# Altium schematic sheet 21_POWER_PWR_SEN.SchDoc
size 420 x 297 mm; SheetNumber: 34; SheetTotal: 36
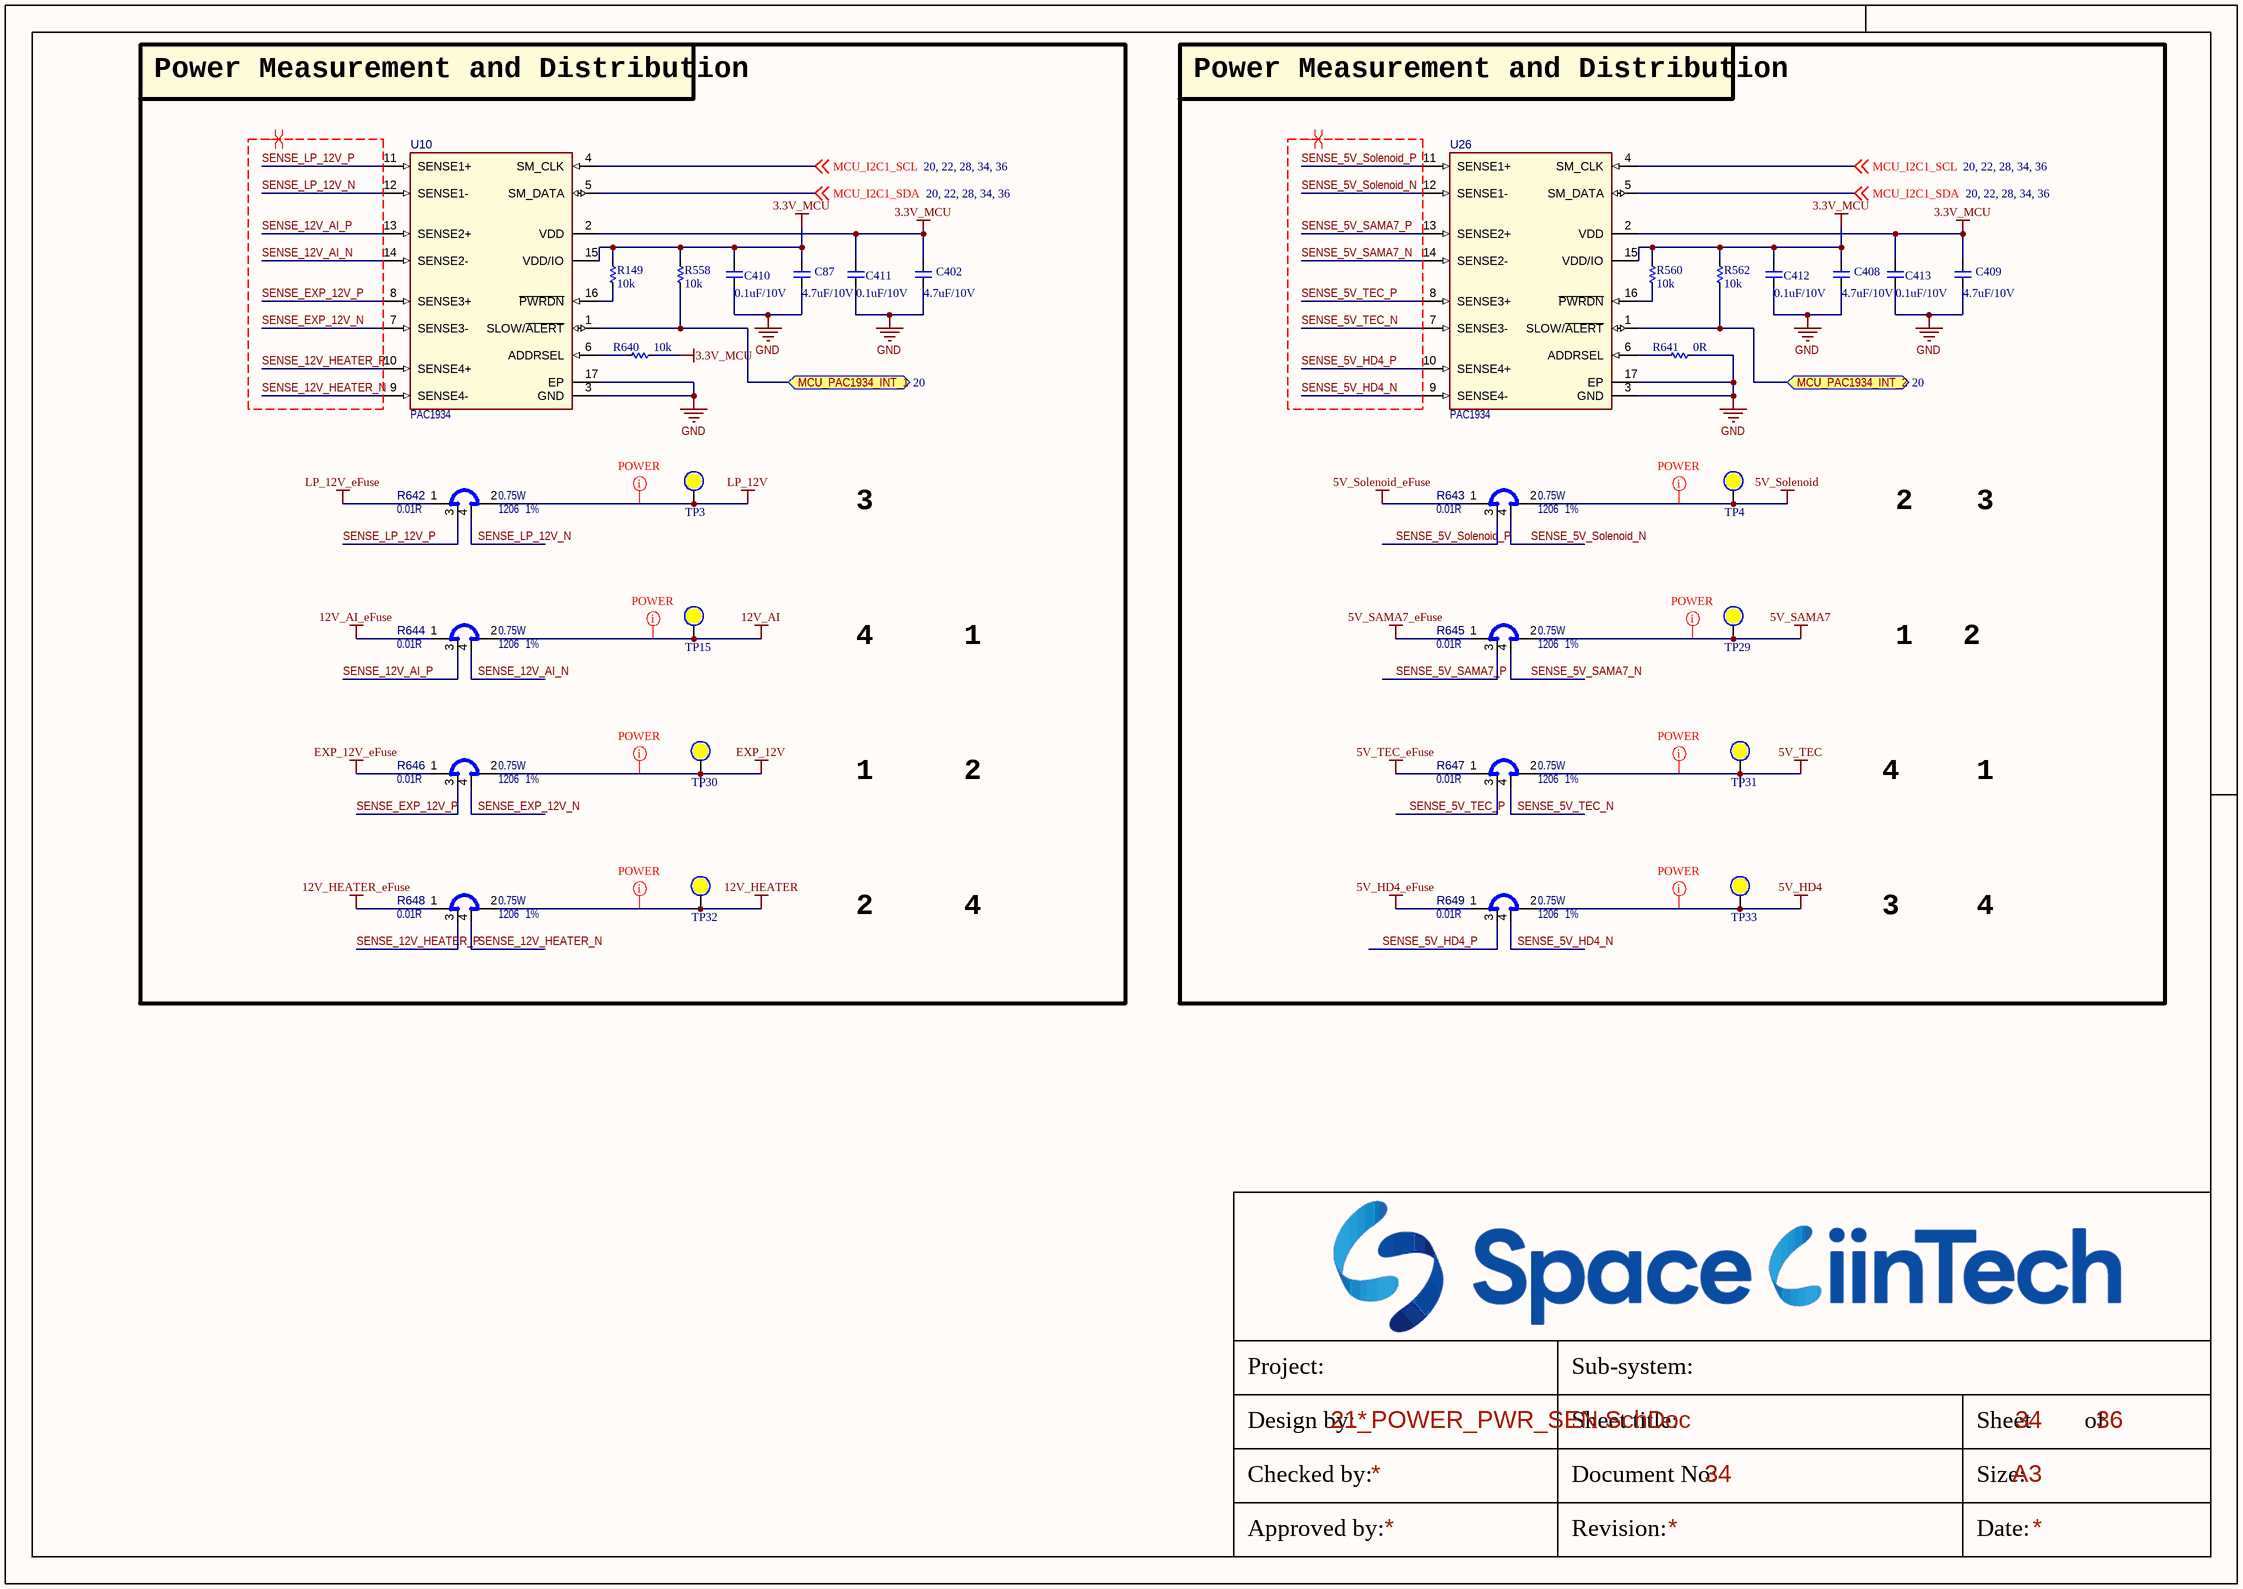
[diagram p0: 21_POWER_PWR_SEN.SchDoc]

## Parts
C87  4.7uF/10V  [CAP_C_1005X60]
C402  4.7uF/10V  [CAP_C_1005X60]
C408  4.7uF/10V  [CAP_C_1005X60]
C409  4.7uF/10V  [CAP_C_1005X60]
C410  0.1uF/10V  [CAP_C_1005X60]
C411  0.1uF/10V  [CAP_C_1005X60]
C412  0.1uF/10V  [CAP_C_1005X60]
C413  0.1uF/10V  [CAP_C_1005X60]
R149  10k  [RES_C_1005X40]
R558  10k  [RES_C_1005X40]
R560  10k  [RES_C_1005X40]
R562  10k  [RES_C_1005X40]
R640  10k  [RES_C_1005X40]
R641  0R  [RES_C_1005X40]
R642  value 0.01R  Package: 1206  Tolerance: 1%  Power: 0.75W  [RES_C_1206_SHUNT]  (hidden comment: KRL1632E-M-R010-F-T5)
R643  value 0.01R  Package: 1206  Tolerance: 1%  Power: 0.75W  [RES_C_1206_SHUNT]  (hidden comment: KRL1632E-M-R010-F-T5)
R644  value 0.01R  Package: 1206  Tolerance: 1%  Power: 0.75W  [RES_C_1206_SHUNT]  (hidden comment: KRL1632E-M-R010-F-T5)
R645  value 0.01R  Package: 1206  Tolerance: 1%  Power: 0.75W  [RES_C_1206_SHUNT]  (hidden comment: KRL1632E-M-R010-F-T5)
R646  value 0.01R  Package: 1206  Tolerance: 1%  Power: 0.75W  [RES_C_1206_SHUNT]  (hidden comment: KRL1632E-M-R010-F-T5)
R647  value 0.01R  Package: 1206  Tolerance: 1%  Power: 0.75W  [RES_C_1206_SHUNT]  (hidden comment: KRL1632E-M-R010-F-T5)
R648  value 0.01R  Package: 1206  Tolerance: 1%  Power: 0.75W  [RES_C_1206_SHUNT]  (hidden comment: KRL1632E-M-R010-F-T5)
R649  value 0.01R  Package: 1206  Tolerance: 1%  Power: 0.75W  [RES_C_1206_SHUNT]  (hidden comment: KRL1632E-M-R010-F-T5)
TP3  (no value)  [Testpoint_80]  (no BOM)
TP4  (no value)  [Testpoint_80]  (no BOM)
TP15  (no value)  [Testpoint_80]  (no BOM)
TP29  (no value)  [Testpoint_80]  (no BOM)
TP30  (no value)  [Testpoint_80]  (no BOM)
TP31  (no value)  [Testpoint_80]  (no BOM)
TP32  (no value)  [Testpoint_80]  (no BOM)
TP33  (no value)  [Testpoint_80]  (no BOM)
U10  value PAC1934  [UQFN-16_4X4_EP2.6X2.6]  (hidden comment: PAC1934 UQFN-16)
U26  value PAC1934  [UQFN-16_4X4_EP2.6X2.6]  (hidden comment: PAC1934 UQFN-16)

## Ports
MCU_PAC1934_INT_1 (bidir, see 20), MCU_PAC1934_INT_2 (bidir, see 20)

## Nets
3.3V_MCU: C87.1 C402.1 C408.1 C409.1 C410.1 C411.1 C412.1 C413.1 R149.1 R558.1 R560.1 R562.1 R640.2 U10.2(VDD) U10.15(VDD/IO) U26.2(VDD) U26.15(VDD/IO)
5V_HD4: R649.2 TP33.1
5V_HD4_eFuse: R649.1
5V_SAMA7: R645.2 TP29.1
5V_SAMA7_eFuse: R645.1
5V_Solenoid: R643.2 TP4.1
5V_Solenoid_eFuse: R643.1
5V_TEC: R647.2 TP31.1
5V_TEC_eFuse: R647.1
12V_AI: R644.2 TP15.1
12V_AI_eFuse: R644.1
12V_HEATER: R648.2 TP32.1
12V_HEATER_eFuse: R648.1
EXP_12V: R646.2 TP30.1
EXP_12V_eFuse: R646.1
GND: C87.2 C402.2 C408.2 C409.2 C410.2 C411.2 C412.2 C413.2 R641.2 U10.3(GND) U10.17(EP) U26.3(GND) U26.17(EP)
LP_12V: R642.2 TP3.1
LP_12V_eFuse: R642.1
MCU_I2C1_SCL: U10.4(SM_CLK) U26.4(SM_CLK) ; off-sheet MCU_I2C1_SCL
MCU_I2C1_SDA: U10.5(SM_DATA) U26.5(SM_DATA) ; off-sheet MCU_I2C1_SDA
MCU_PAC1934_INT_1: R558.2 U10.1(SLOW/~{ALERT}) ; port MCU_PAC1934_INT_1
MCU_PAC1934_INT_2: R562.2 U26.1(SLOW/~{ALERT}) ; port MCU_PAC1934_INT_2
SENSE_5V_HD4_N: R649.4 U26.9(SENSE4-)
SENSE_5V_HD4_P: R649.3 U26.10(SENSE4+)
SENSE_5V_SAMA7_N: R645.4 U26.14(SENSE2-)
SENSE_5V_SAMA7_P: R645.3 U26.13(SENSE2+)
SENSE_5V_Solenoid_N: R643.4 U26.12(SENSE1-)
SENSE_5V_Solenoid_P: R643.3 U26.11(SENSE1+)
SENSE_5V_TEC_N: R647.4 U26.7(SENSE3-)
SENSE_5V_TEC_P: R647.3 U26.8(SENSE3+)
SENSE_12V_AI_N: R644.4 U10.14(SENSE2-)
SENSE_12V_AI_P: R644.3 U10.13(SENSE2+)
SENSE_12V_HEATER_N: R648.4 U10.9(SENSE4-)
SENSE_12V_HEATER_P: R648.3 U10.10(SENSE4+)
SENSE_EXP_12V_N: R646.4 U10.7(SENSE3-)
SENSE_EXP_12V_P: R646.3 U10.8(SENSE3+)
SENSE_LP_12V_N: R642.4 U10.12(SENSE1-)
SENSE_LP_12V_P: R642.3 U10.11(SENSE1+)
NetR149_2: R149.2 U10.16(~{PWRDN})
NetR560_2: R560.2 U26.16(~{PWRDN})
NetR640_1: R640.1 U10.6(ADDRSEL)
NetR641_1: R641.1 U26.6(ADDRSEL)

## Layout directives
net class POWER: 5V_HD4, 5V_SAMA7, 5V_Solenoid, 5V_TEC, 12V_AI, 12V_HEATER, EXP_12V, LP_12V
differential pair; net class DIFF100; differential pair class DIFF100: SENSE_5V_HD4_N, SENSE_5V_HD4_P, SENSE_5V_SAMA7_N, SENSE_5V_SAMA7_P, SENSE_5V_Solenoid_N, SENSE_5V_Solenoid_P, SENSE_5V_TEC_N, SENSE_5V_TEC_P, SENSE_12V_AI_N, SENSE_12V_AI_P, SENSE_12V_HEATER_N, SENSE_12V_HEATER_P, SENSE_EXP_12V_N, SENSE_EXP_12V_P, SENSE_LP_12V_N, SENSE_LP_12V_P

## Notes on the sheet
- Power Measurement and Distribution
- 3
- 2
- 4
- 1
- Project:
- Sub-system:
- Design by:
- Sheet title:
- Sheet
- of
- Checked by:
- Approved by:
- Revision:
- Document No:
- Size:
- Date:
- A3

## Library data of the parts
C87 C402 C408-C413 = _CAP_C_2: CAP
R149 R558 R560 R562 R640 R641 = _RES_B_2: RES
R642-R649 = RSMT1316: Shunt; Manufacturer 1: SUSUMU; Description_: RES SHUNT MF 0.01R 1% 0.75W SMD 1206; Dev Tools Status: Design; Temperature Coeffcient: 50ppm/C; Current: 8A; Owner: Ciprian Abramov; Populated: YES; MCHP-ID: RSMT1316; Revision: 1; Symbol: Shunt 4 Pin; Status: MCL Design; ComponentLink1URL: https://chn-vm-apps.microchip.com/mchprepo/parts/Datasheets/n_catalog_partition09_en.pdf; ComponentLink1Description: SVN Datasheet; ComponentLink2URL: C:\ALTIUM_WORK\00001_MCHP-CDB\Datasheets\n_catalog_partition09_en.pdf; ComponentLink2Description: Local Datasheet; ComponentLink3URL: C:\ALTIUM_WORK\00001_MCHP-CDB\Library\LibraryRefs\Shunt 4 Pin.SchLib; ComponentLink3Description: Open Symbol; ComponentLink4URL: C:\ALTIUM_WORK\00001_MCHP-CDB\Library\Footprints\RES_C_1206_SHUNT.PcbLib; ComponentLink4Description: Open Footprint; ComponentLink5Description: Open Footprint 2; ComponentLink6Description: Open Footprint 3; ComponentLink7Description: Open Footprint 4; Operating Temperature: -55C to +155C; Category: Resistor; Type: RES SMD; Composition: MF; Manufacturer Part Number 1: KRL1632E-M-R010-F-T5; Supplier 1: Digi-Key; Supplier Part Number 1: 408-1570-1-ND; Quantity Override: 1
TP3 TP4 TP15 TP29-TP33 = Test Point: Solder: NF
U10 U26 = MIC8883: Manufacturer 1: Microchip Technology; Manufacturer Part Number 1: PAC1934T-I/JQ; Description_: MCHP ANALOG POWER CURRENT SENSE MONITOR PAC1934T-I/JQ UQFN-16; Dev Tools Status: Design; Owner: Ciprian Abramov; Populated: YES; MCHP-ID: MIC8883; Symbol: PAC1934 UQFN-16; Type: Power/Current Sensor; Status: MCL Design; Revision: 1; Category: MCHP-Analog; ComponentLink1Description: SVN Datasheet; ComponentLink2Description: Local Datasheet; ComponentLink3URL: C:\ALTIUM_WORK\00001_MCHP-CDB\Library\LibraryRefs\PAC1934 UQFN-16.SchLib; ComponentLink3Description: Open Symbol; ComponentLink4URL: C:\ALTIUM_WORK\00001_MCHP-CDB\Library\Footprints\UQFN-16_4X4_EP2.6X2.6.PcbLib; ComponentLink4Description: Open Footprint; ComponentLink5Description: Open Footprint 2; ComponentLink6Description: Open Footprint 3; ComponentLink7Description: Open Footprint 4; Supplier 1: Digi-Key; Supplier Part Number 1: PAC1934T-I/JQCT-ND; Quantity Override: 1